# EAGLE design 5050LED (EAGLE 6.3)
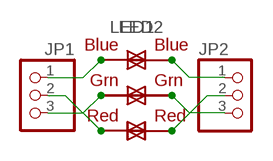
[diagram p0: schematic, sheet 1]

## Parts
JP1  PINHD-1X3CB  [1X03-CLEANBIG]
JP2  PINHD-1X3CB  [1X03-CLEANBIG]
LED1  RGBLED5050  [RGBLED5050]
LED2  RGBLED5050  [RGBLED5050]

## Nets
N$1: JP1.1 LED1.3(BLUE_A) LED2.4(BLUE_C)
N$2: JP1.2 LED1.2(RED_A) LED2.5(RED_C)
N$3: JP1.3 LED1.1(GREEN_A) LED2.6(GREEN_C)
N$4: JP2.1 LED1.4(BLUE_C) LED2.3(BLUE_A)
N$5: JP2.2 LED1.5(RED_C) LED2.2(RED_A)
N$6: JP2.3 LED1.6(GREEN_C) LED2.1(GREEN_A)

## Library data of the parts
JP1 JP2 = adafruit:PINHD-1X3: PIN HEADER
LED1 LED2 = adafruit:RGBLED: For 5050 RGB LEDs, the order of the LEDs may vary from one manufacturer to another!

## Board
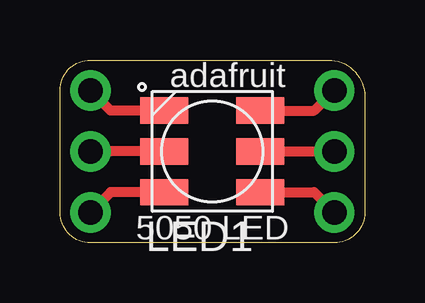
[diagram p1: board, top side]
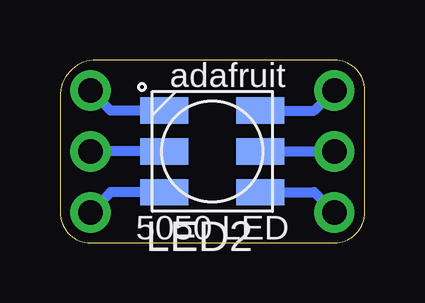
[diagram p2: board, bottom side, seen from below]

Size 12.7 x 7.62 mm. Coordinates in mm from the lower left corner, seen from the top.
Outline: 0,1.27 0,6.35 arc-90 1.27,7.62 11.18,7.62 arc-90 12.7,6.1 12.7,1.27 arc-90 11.43,0 1.27,0 arc-90 0,1.27
Copper layers (1*16): Top 0.035mm / dielectric 1.5mm / Bottom 0.035mm
Design rules "default": minimum track width 10mil, minimum drill 16mil, track to track 8mil, track to pad 8mil, pad to pad 8mil, via to via 8mil, smd to smd 8mil, copper to edge 10mil, drill to drill 8mil, minimum pad ring 10mil, minimum via ring 8mil, stop-mask expansion 4mil, vias tented up to drill 20mil, thermal gap 10mil

### Footprints (pad centres in the part's own frame; a part is rotated, then mirrored left to right if it is on the bottom)
1X03-CLEANBIG = drill 1.016 pad 1.676: 1 -2.54,0; 2 0,0; 3 2.54,0
RGBLED5050 = smd 2 x 1.1: 1 -2,1.7; 2 -2,0; 3 -2,-1.7; 4 2,-1.7; 5 2,0; 6 2,1.7

### Placement (x,y rotation side)
JP1  11.43,3.81 270 top
JP2  1.27,3.81 270 top
LED1  6.35,3.81 180 top
LED2  6.35,3.81 180 bottom

### Tracks (layer width: path | path; a pad name or v marks a point on that pad's centre or on a via)
N$1
  Top 0.406: LED2.4 10.59,5.51 JP1.1
  Bottom 0.406: LED2.4 10.59,5.51 JP1.1
N$2
  Top 0.406: LED2.5 JP1.2
  Bottom 0.406: LED2.5 JP1.2
N$3
  Top 0.406: LED2.6 10.59,2.11 JP1.3
  Bottom 0.406: LED2.6 10.59,2.11 JP1.3
N$4
  Top 0.406: LED2.3 2.11,5.51 JP2.1
  Bottom 0.406: LED2.3 2.11,5.51 JP2.1
N$5
  Top 0.406: LED2.2 JP2.2
  Bottom 0.406: LED2.2 JP2.2
N$6
  Top 0.406: LED2.1 2.11,2.11 JP2.3
  Bottom 0.406: LED2.1 2.11,2.11 JP2.3

### Text on the board
tPlace: adafruit | 5050 LED
bPlace: adafruit | 5050 LED